# EAGLE design ballistic-amp (EAGLE 7.5.0)
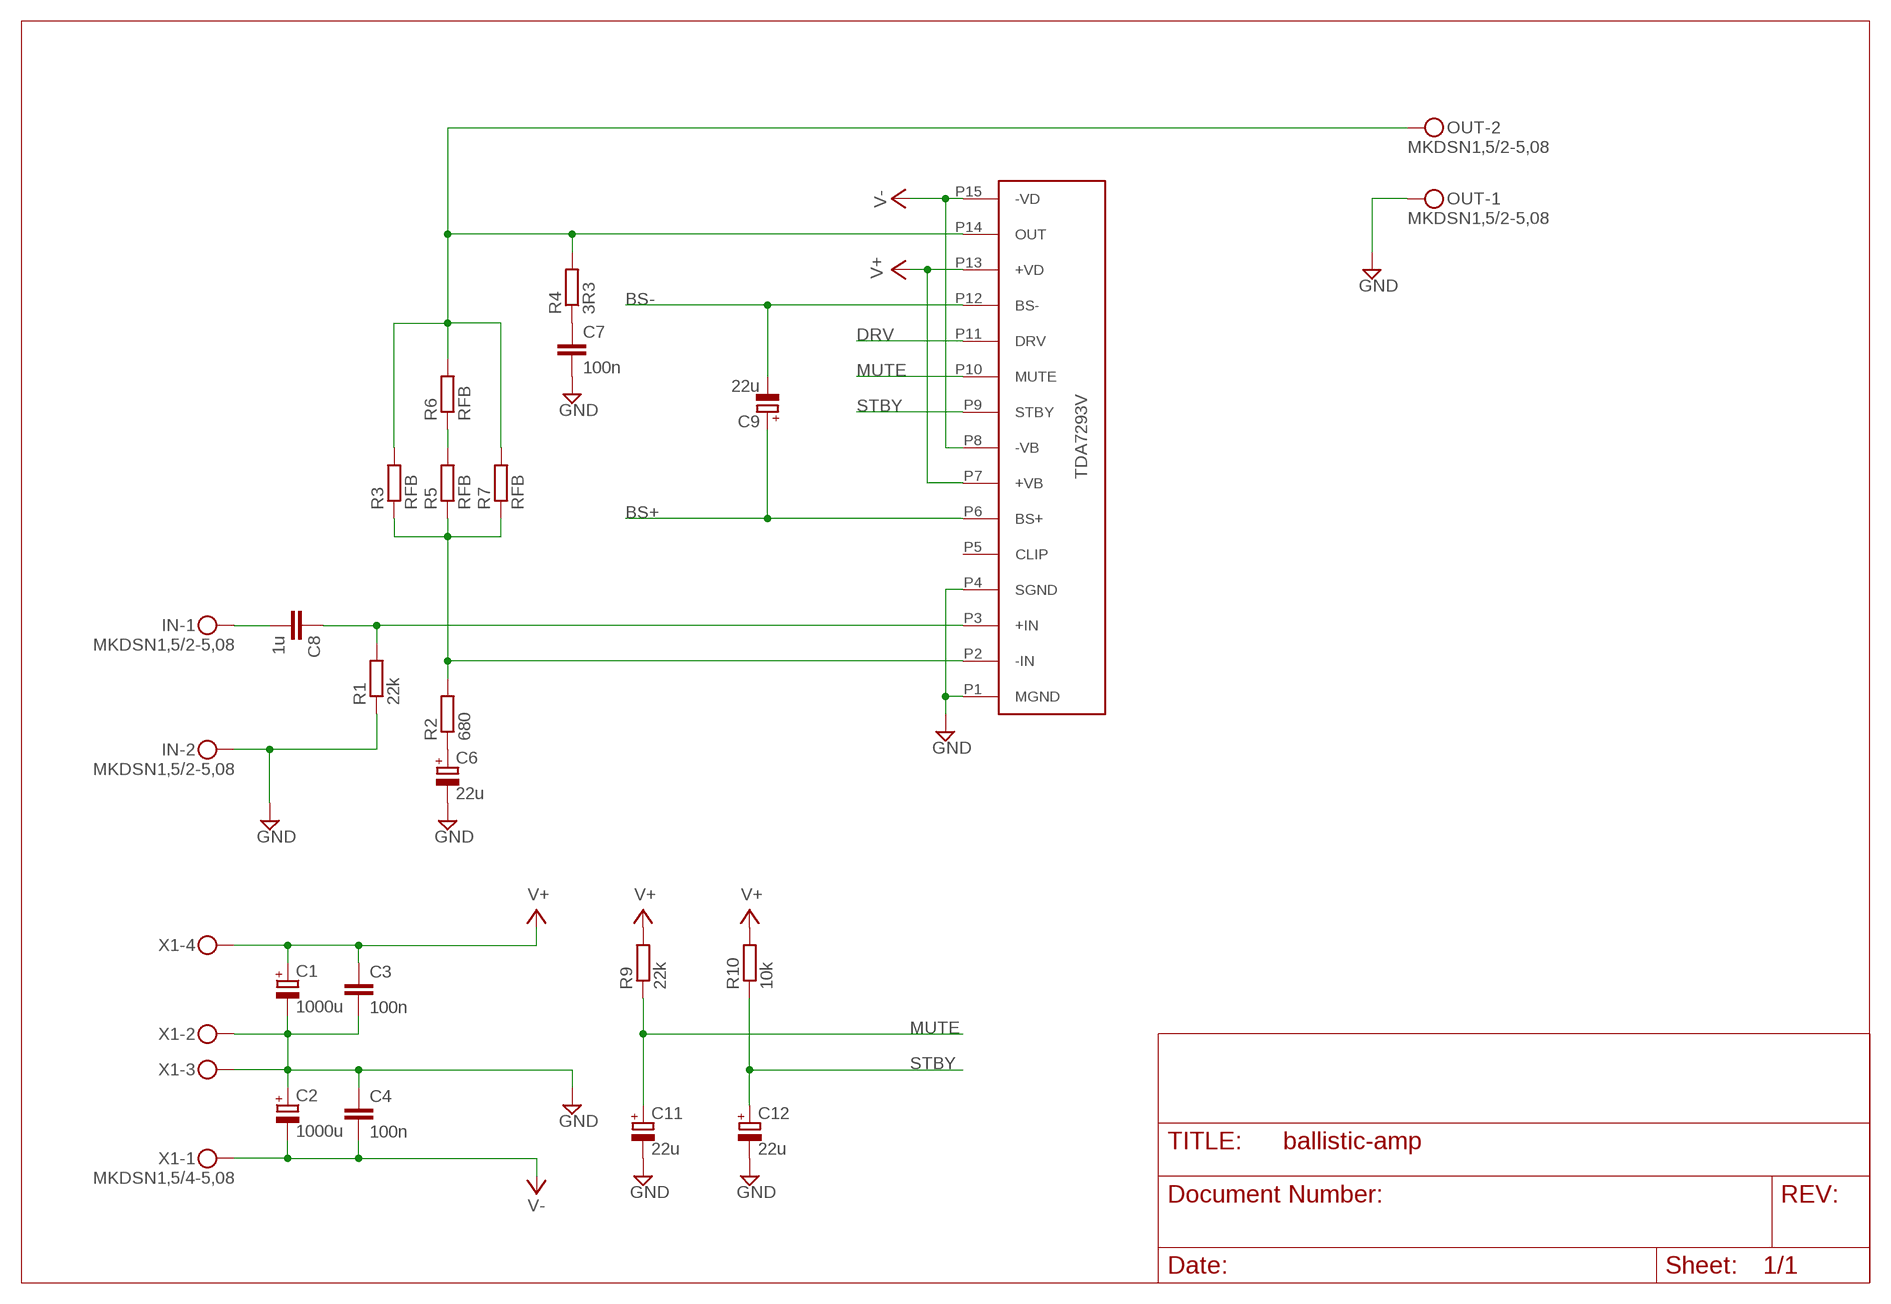
[diagram p0: schematic, sheet 1]

## Parts
C1  1000u  CPOL-EUE7.5-18  [E7,5-18]
C2  1000u  CPOL-EUE7.5-18  [E7,5-18]
C3  100n  C-EU050-025X075  [C050-025X075]
C4  100n  C-EU050-025X075  [C050-025X075]
C6  22u  CPOL-EUE5-10.5  [E5-10,5]
C7  100n  C-EU050-025X075  [C050-025X075]
C8  1u  C-EUC1210  [C1210]
C9  22u  CPOL-EUE5-10.5  [E5-10,5]
C11  22u  CPOL-EUUD-6,3X7,7  [UD-6,3X7,7_NICHICON]
C12  22u  CPOL-EUUD-6,3X7,7  [UD-6,3X7,7_NICHICON]
IN  MKDSN1,5/2-5,08  [MKDSN1,5/2-5,08]
OUT  MKDSN1,5/2-5,08  [MKDSN1,5/2-5,08]
R1  22k  R-EU_0207/10  [0207/10]
R2  680  R-EU_0207/10  [0207/10]
R3  RFB  R-EU_0207/10  [0207/10]
R4  3R3  R-EU_R2512  [R2512]
R5  RFB  R-EU_0207/10  [0207/10]
R6  RFB  R-EU_0207/10  [0207/10]
R7  RFB  R-EU_0207/10  [0207/10]
R9  22k  R-EU_0207/10  [0207/10]
R10  10k  R-EU_0207/10  [0207/10]
U$1  TDA7293V  [TDA7293V]
X1  MKDSN1,5/4-5,08  [MKDSN1,5/4-5,08]

## Nets
BS+: C9.+ U$1.P6(BS+)
BS-: C9.- U$1.P12(BS-)
DRV: U$1.P11(DRV)
GND: C1.- C2.+ C3.2 C4.1 C6.- C7.2 C11.- C12.- IN.2 OUT.1 R1.1 U$1.P1(MGND) U$1.P4(SGND) X1.2 X1.3
MUTE: C11.+ R9.1 U$1.P10(MUTE)
N$1: C6.+ R2.1
N$2: R2.2 R3.1 R5.1 R7.1 U$1.P2(-IN)
N$3: C7.1 R4.1
N$4: C8.2 IN.1
N$5: C8.1 R1.2 U$1.P3(+IN)
N$6: OUT.2 R3.2 R4.2 R6.2 R7.2 U$1.P14(OUT)
N$7: R5.2 R6.1
STBY: C12.+ R10.1 U$1.P9(STBY)
V+: C1.+ C3.1 R9.2 R10.2 U$1.P7(+VB) U$1.P13(+VD) X1.4
V-: C2.- C4.2 U$1.P8(-VB) U$1.P15(-VD) X1.1
Unconnected: U$1.P5(CLIP)

## Library data of the parts
C1 C2 C6 C9 C11 C12 = rcl:CPOL-EU: POLARIZED CAPACITOR, European symbol
C3 C4 C7 C8 = rcl:C-EU: CAPACITOR, European symbol
IN OUT = con-phoenix-508:MKDSN1,5/2-5,08: MKDSN 1,5/ 2-5,08 Printklemme Nennstrom: 13,5 A Nennspannung: 250 V Rastermaß: 5,08 mm Polzahl: 2 Anschlussart: Schraubanschluss Montage: Löten Anschlussrichtung Leiter/Platine: 0 ° Artikelnummer: 1729128 Source: http://eshop.phoenixcontact.com .. 1729128.pdf
R1-R7 R9 R10 = rcl:R-EU_: RESISTOR, European symbol
U$1 = TDA7293V:TDA7293V
X1 = con-phoenix-508:MKDSN1,5/4-5,08: MKDSN 1,5/ 4-5,08 Printklemme Nennstrom: 13,5 A Nennspannung: 250 V Rastermaß: 5,08 mm Polzahl: 4 Anschlussart: Schraubanschluss Montage: Löten Anschlussrichtung Leiter/Platine: 0 ° Artikelnummer: 1729144 Source: http://eshop.phoenixcontact.com .. 1729144.pdf

## Board
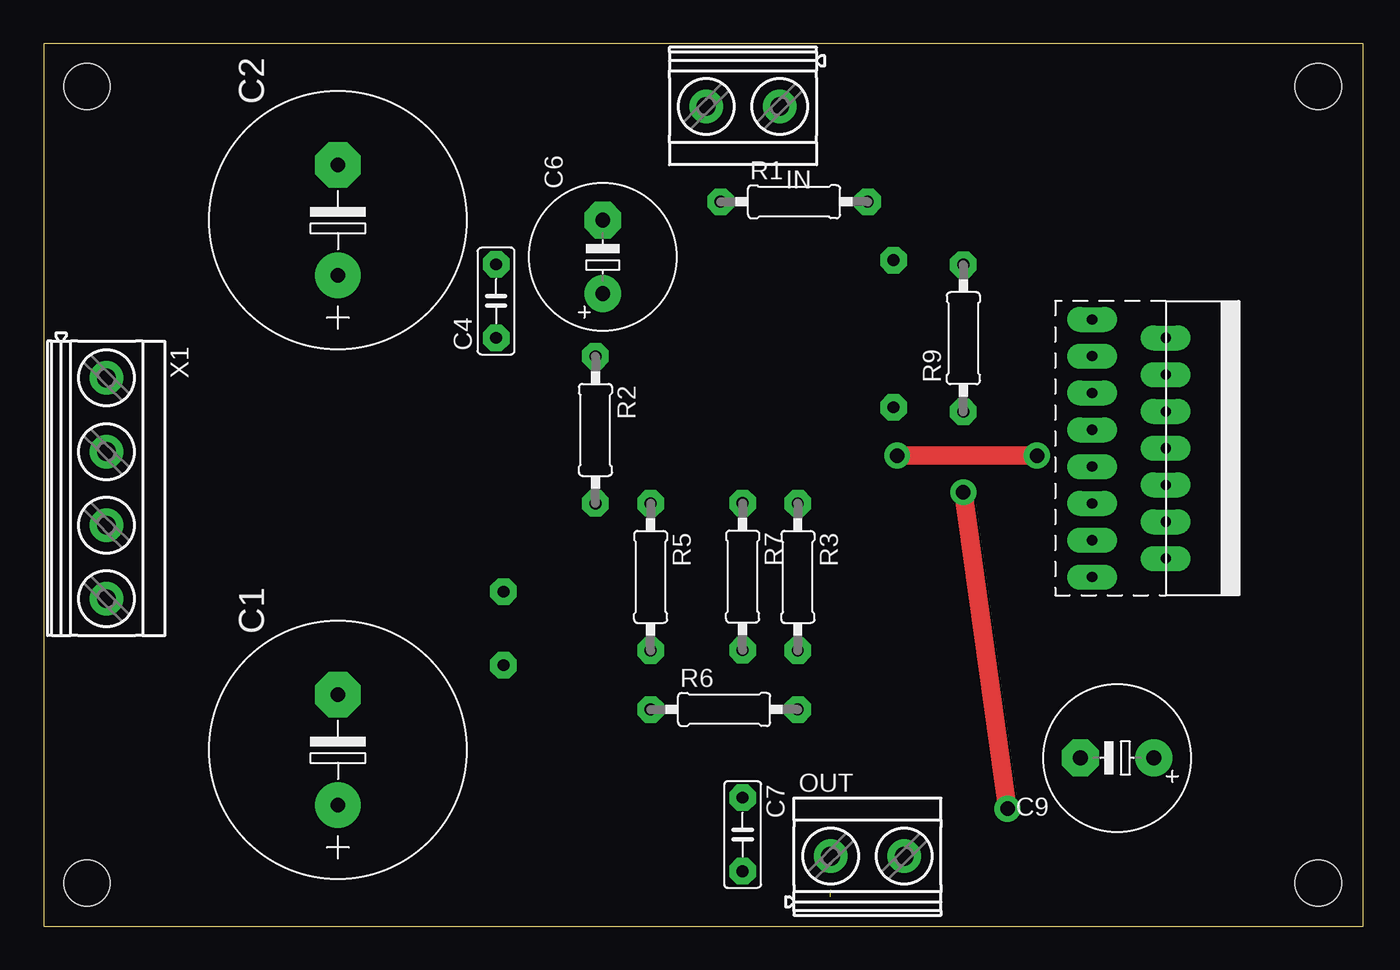
[diagram p1: board, top side]
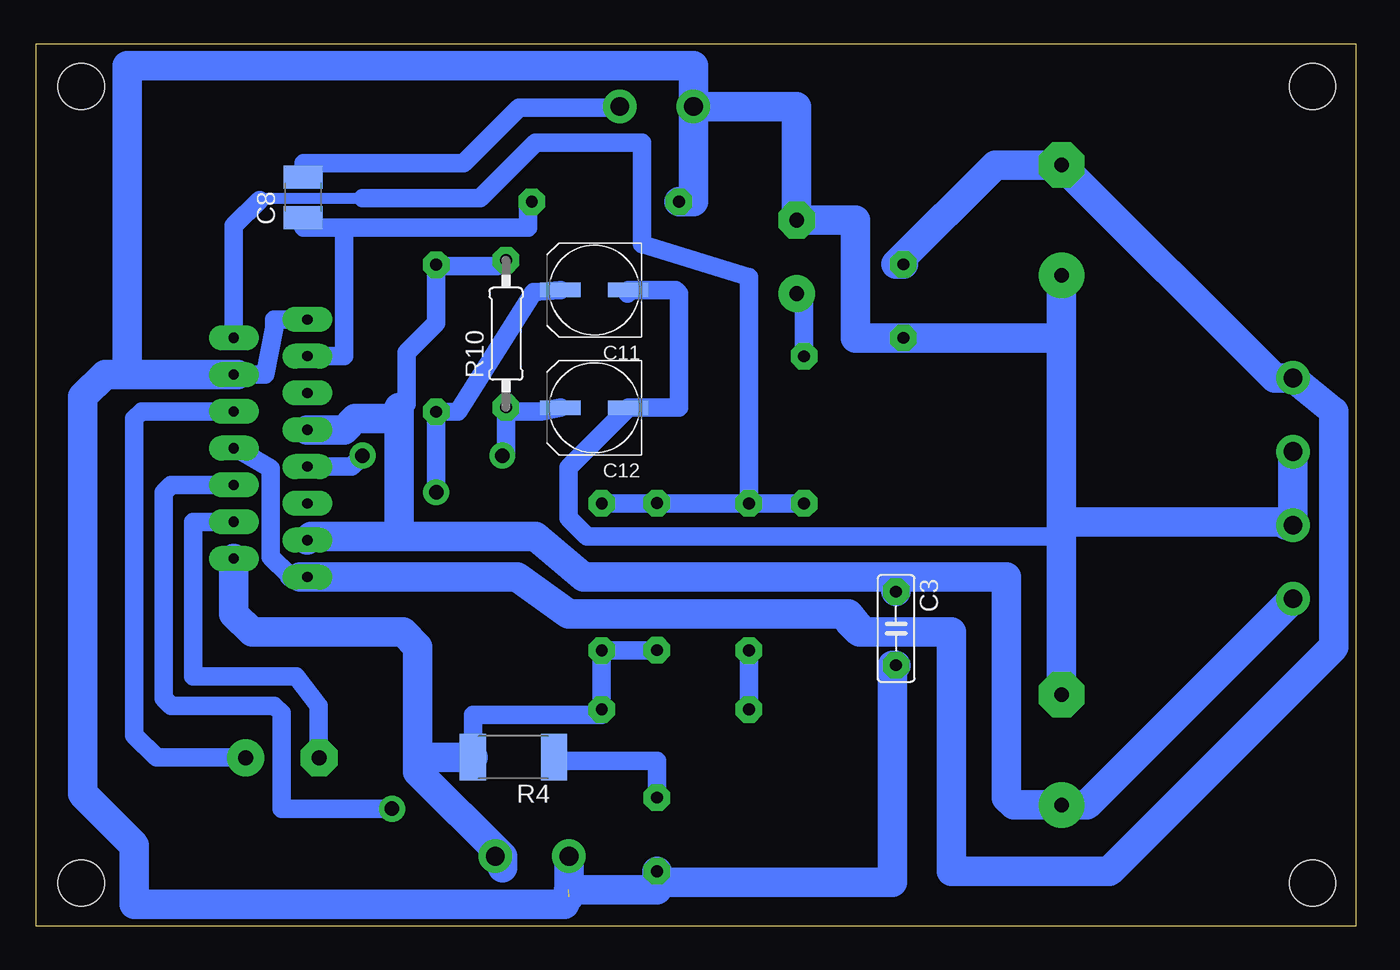
[diagram p2: board, bottom side, seen from below]

Size 91.11 x 60.95 mm. Coordinates in mm from the lower left corner, seen from the top.
Outline: 0,0 91.11,0 91.11,60.95 0,60.95 0,0
Copper layers (1*16): Top 0.035mm / dielectric 1.5mm / Bottom 0.035mm
Design rules "default *": minimum track width 50mil, minimum drill 24mil, track to track 8mil, track to pad 8mil, pad to pad 8mil, via to via 8mil, smd to smd 8mil, copper to edge 40mil, drill to drill 8mil, minimum pad ring 20mil, minimum via ring 8mil, stop-mask expansion 4mil, vias tented up to drill 0mil, thermal gap 10mil
Holes 3.2 mm at 88,58 88,3 3,3 3,58

### Footprints (pad centres in the part's own frame; a part is rotated, then mirrored left to right if it is on the bottom)
E7,5-18 = drill 1.016 pad 3.15: + -3.81,0 | drill 1.016 pad 3.15 octagon: - 3.81,0
C050-025X075 = drill 0.813 octagon: 1 -2.54,0; 2 2.54,0
E5-10,5 = drill 1.016 pad 2.54: + -2.54,0 | drill 1.016 pad 2.54 octagon: - 2.54,0
C1210 = smd 1.6 x 2.7: 1 -1.4,0; 2 1.4,0
UD-6,3X7,7_NICHICON = smd 2.8 x 1: + 2.35,0; - -2.35,0
MKDSN1,5/2-5,08 = drill 1.3 pad 2: 1 -2.561,0.025; 2 2.519,0.025
0207/10 = drill 0.813 octagon: 1 -5.08,0; 2 5.08,0
R2512 = smd 1.8 x 3.2: 1 -2.8,0; 2 2.8,0
TDA7293V = drill 0.7 pad 1.422 long: P1 1.27,-5.08; P2 2.54,0; P3 3.81,-5.08; P4 5.08,0; P5 6.35,-5.08; P6 7.62,0; P7 8.89,-5.08; P8 10.16,0; P9 11.43,-5.08; P10 12.7,0; P11 13.97,-5.08; P12 15.24,0; P13 16.51,-5.08; P14 17.78,0; P15 19.05,-5.08
MKDSN1,5/4-5,08 = drill 1.3 pad 2: 1 -7.641,0.025; 2 -2.561,0.025; 3 2.519,0.025; 4 7.599,0.025

### Placement (x,y rotation side)
C1  20.32,12.19 90 top
C2  20.32,48.77 90 top
C3  31.75,20.57 270 bottom
C4  31.24,43.18 90 top
C6  38.61,46.23 90 top
C7  48.26,6.35 270 top
C8  72.69,50.34 90 bottom
C9  74.12,11.63 180 top
C11  52.58,43.94 180 bottom
C12  52.58,35.81 180 bottom
IN  48.26,56.64 180 top
OUT  56.9,4.83 0 top
R1  51.82,50.04 0 top
R2  38.1,34.29 270 top
R3  52.07,24.13 270 top
R4  58.17,11.68 180 bottom
R5  41.91,24.13 270 top
R6  46.99,14.99 0 top
R7  48.26,24.16 270 top
R9  63.5,40.61 90 top
R10  58.67,40.92 90 bottom
U$1  77.47,43.18 270 top
X1  4.32,30.23 270 top

### Tracks (layer width: path | path; a pad name or v marks a point on that pad's centre or on a via)
BS+
  Bottom 1.27: U$1.P6 83.82,35.56 84.33,35.05 84.33,13.21 82.8,11.68 76.71,11.68 C9.+
BS-
  Bottom 1.27: U$1.P12 80.26,27.94 80.26,17.27 73.15,17.27 71.63,15.24 71.63,12.09 C9.-
GND  (1 unrouted)
  Bottom 1.27: U$1.P1 74.68,41.91 74.68,41.27 75.31,38.1 77.22,38.1 U$1.P4 | 20.32,26.92 53.09,26.92 54.36,28.19 54.36,31.69 C12.- 46.74,35.81 46.74,43.69 46.99,43.94 50.04,43.94 50.29,43.69 50.29,43.88 C11.-
  Bottom 2.032: X1.2 X1.3 4.85,27.71 5.08,27.94 20.32,27.94 | IN.2 38.61,56.62 C6.- 34.54,48.77 34.54,40.64 C4.1 20.32,40.64 | R1.1 45.74,50.04 IN.2 | C3.2 32,18.03 32,3.05 48.26,3.05 | 48.26,3.05 C7.2 | 54.36,2.54 48.26,2.54 48.26,3.05 | 84.84,38.1 84.84,59.44 45.74,59.44 IN.2 | 54.86,1.52 84.33,1.52 84.33,5.59 87.88,9.14 87.88,36.58 86.36,38.1 84.84,38.1 | 54.86,1.52 54.63,1.52 | 77.22,38.1 84.84,38.1 | OUT.1 54.34,2.05 54.86,1.52 | 20.32,27.94 20.32,26.92 C1.- | 20.32,27.94 20.32,40.64 | 20.32,40.64 C2.+
MUTE  (via drill 1 pad 1.78)
  Top 1.27: v63.5,29.97 v66.55,8.13
  Bottom 1.27: C11.+ 56.77,43.81 61.98,35.56 R9.1 v63.5,29.97 | U$1.P10 81.79,30.48 82.3,29.97 82.3,15.75 81.79,15.24 74.68,15.24 74.17,14.73 74.17,8.13 v66.55,8.13
N$1
  Bottom 1.27: R2.1 38.1,43.18 C6.+
N$2
  Bottom 0.762: 75.69,50.16 75.56,50.29 68.58,50.29
  Bottom 1.27: 48.26,29.21 R3.1 | U$1.P2 77.47,48.39 75.69,50.16 | R5.1 41.91,44.83 49.28,47.12 49.28,54.1 56.64,54.1 60.45,50.29 68.58,50.29 | R5.1 R2.2 | R5.1 48.26,29.21 | 48.26,29.21 R7.1
N$3
  Bottom 1.27: C7.1 48.26,11.43 55.24,11.43 R4.1
N$4
  Bottom 1.27: C8.2 72.64,52.7 61.59,52.7 57.78,56.52 51.44,56.52 IN.1
N$5
  Bottom 1.27: 69.85,48.26 57.15,48.26 57.15,49.53 R1.2 | 69.85,48.26 72.64,48.26 72.69,48.31 C8.1 | U$1.P3 69.85,39.37 69.85,48.26
N$6
  Bottom 0.097: OUT.2 59.41,4.55 58.93,4.06
  Bottom 1.27: R7.2 48.26,19.05 R3.2 R6.2 52.07,14.61 60.96,14.61 60.96,12.06 R4.2
  Bottom 2.032: U$1.P14 77.47,21.59 76.2,20.32 65.79,20.32 64.77,19.3 64.77,11.68 | 64.77,11.68 64.77,10.67 58.93,4.83 58.93,4.06 | R4.2 64.77,11.68
N$7
  Bottom 1.27: R5.2 R6.1
STBY  (via drill 1 pad 1.78)
  Top 1.27: v58.93,32.51 v68.58,32.51
  Bottom 1.27: 58.67,35.56 56.26,35.56 C12.+ | 58.67,35.56 R10.1 58.67,35.94 | 58.67,35.56 58.67,32.77 v58.93,32.51 | U$1.P9 69.34,31.75 v68.58,32.51
V+
  Bottom 1.27: 63.5,45.59 59.31,45.59 R10.2 | 63.5,45.59 63.5,41.66 65.53,39.62 65.53,36.07 66.04,35.56 | 63.5,45.59 R9.2
  Bottom 2.032: 66.04,26.92 56.64,26.92 53.34,24.13 31.75,24.13 | 66.04,26.92 72.14,26.92 U$1.P13 | 66.04,35.81 66.04,35.56 66.04,35.05 | 66.04,35.05 66.04,26.92 | U$1.P7 69.85,34.29 69.09,35.05 66.04,35.05 | X1.4 18.59,8.38 C1.+ 23.62,8.38 24.13,8.89 24.13,24.13 31.75,24.13 | C3.1 31.75,24.13
V-
  Bottom 1.27: U$1.P15 72.9,24.13 73.66,24.13 73.66,24.26 74.93,25.53 74.93,31.62 77.34,33.02 U$1.P8
  Bottom 2.032: 72.9,24.13 57.91,24.13 54.36,21.59 35.05,21.59 | 35.05,21.59 34.04,20.32 | C4.2 31.75,45.72 24.89,52.58 C2.- 5.61,37.87 X1.1 1.52,35.56 1.52,19.3 17.02,3.81 27.94,3.81 27.94,20.32 34.04,20.32 | 35.05,21.59 35.05,21.08 34.29,20.32 | 34.29,20.32 34.04,20.32 | 35.05,21.59 34.29,20.32